# Altium schematic sheet Main_Schematic.SchDoc
size A4; SheetNumber: 1; SheetTotal: 5
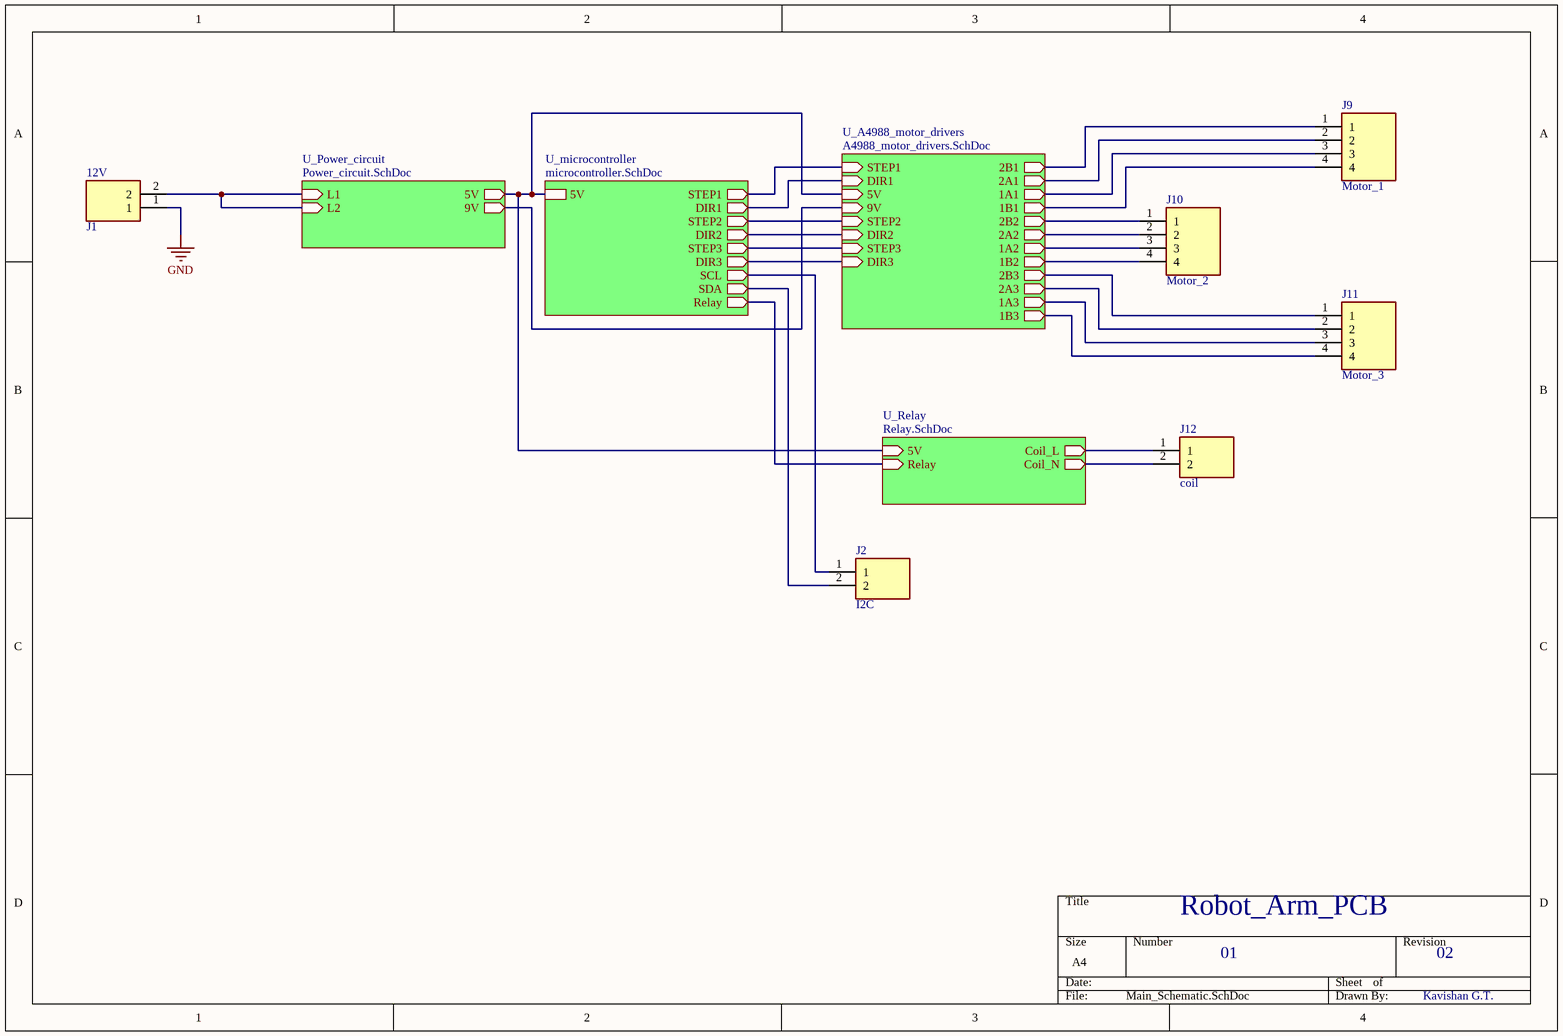
[diagram p0: Main_Schematic.SchDoc]

## Parts
J1  12V  [SHDR2W64P0X250_1X2_750X380X600P]
J2  I2C  [SHDR2W64P0X250_1X2_750X380X600P]
J9  Motor_1  [RHDR4W80P0X254_1X4_1066X254X850P]
J10  Motor_2  [RHDR4W80P0X254_1X4_1066X254X850P]
J11  Motor_3  [RHDR4W80P0X254_1X4_1066X254X850P]
J12  coil  [SHDR2W64P0X250_1X2_750X380X600P]

## Sub-sheets
U_A4988_motor_drivers = A4988_motor_drivers.SchDoc: STEP1 (in), DIR1 (in), 5V (in), 9V (in), 2B1 (out), 2A1 (out), 1A1 (out), 1B1 (out), STEP2 (in), DIR2 (in), 2B2 (out), 2A2 (out), 1A2 (out), 1B2 (out), STEP3 (in), DIR3 (in), 2B3 (out), 2A3 (out), 1A3 (out), 1B3 (out)
U_microcontroller = microcontroller.SchDoc: 5V, STEP1 (out), DIR1 (out), STEP2 (out), DIR2 (out), STEP3 (out), DIR3 (out), SCL (out), SDA (out), Relay (out)
U_Power_circuit = Power_circuit.SchDoc: L1 (in), 5V (out), L2 (in), 9V (out)
U_Relay = Relay.SchDoc: 5V (in), Relay (in), Coil_L (out), Coil_N (out)

## Nets
GND: J1.1
NetJ1_2: J1.2 ; sheet U_Power_circuit/L1, sheet U_Power_circuit/L2
NetJ2_1: J2.1 ; sheet U_microcontroller/SCL
NetJ2_2: J2.2 ; sheet U_microcontroller/SDA
NetJ9_1: J9.1 ; sheet U_A4988_motor_drivers/2B1
NetJ9_2: J9.2 ; sheet U_A4988_motor_drivers/2A1
NetJ9_3: J9.3 ; sheet U_A4988_motor_drivers/1A1
NetJ9_4: J9.4 ; sheet U_A4988_motor_drivers/1B1
NetJ10_1: J10.1 ; sheet U_A4988_motor_drivers/2B2
NetJ10_2: J10.2 ; sheet U_A4988_motor_drivers/2A2
NetJ10_3: J10.3 ; sheet U_A4988_motor_drivers/1A2
NetJ10_4: J10.4 ; sheet U_A4988_motor_drivers/1B2
NetJ11_1: J11.1 ; sheet U_A4988_motor_drivers/2B3
NetJ11_2: J11.2 ; sheet U_A4988_motor_drivers/2A3
NetJ11_3: J11.3 ; sheet U_A4988_motor_drivers/1A3
NetJ11_4: J11.4 ; sheet U_A4988_motor_drivers/1B3
NetJ12_1: J12.1 ; sheet U_Relay/Coil_L
NetJ12_2: J12.2 ; sheet U_Relay/Coil_N
(unnamed): sheet U_microcontroller/5V, sheet U_A4988_motor_drivers/5V, sheet U_Relay/5V, sheet U_Power_circuit/5V
(unnamed): sheet U_microcontroller/STEP1, sheet U_A4988_motor_drivers/STEP1
(unnamed): sheet U_microcontroller/DIR1, sheet U_A4988_motor_drivers/DIR1
(unnamed): sheet U_microcontroller/STEP2, sheet U_A4988_motor_drivers/STEP2
(unnamed): sheet U_microcontroller/DIR2, sheet U_A4988_motor_drivers/DIR2
(unnamed): sheet U_microcontroller/STEP3, sheet U_A4988_motor_drivers/STEP3
(unnamed): sheet U_microcontroller/DIR3, sheet U_A4988_motor_drivers/DIR3
(unnamed): sheet U_microcontroller/Relay, sheet U_Relay/Relay
(unnamed): sheet U_A4988_motor_drivers/9V, sheet U_Power_circuit/9V

## Notes on the sheet
- Robot_Arm_PCB
- 01
- 02
- Kavishan G.T.

## Library data of the parts
J1 J2 J12 = B2B-EH-A: Connector; Manufacturer_Name: JST (JAPAN SOLDERLESS TERMINALS); Datasheet Link: http://www.jst-mfg.com/product/pdf/eng/eEH.pdf; Height: 6mm; Manufacturer_Part_Number: B2B-EH-A
J9-J11 = PPPC041LFBN-RC: Connector; Manufacturer_Name: Sullins; Datasheet Link: https://drawings-pdf.s3.amazonaws.com/10492.pdf; Height: 8.5mm; Manufacturer_Part_Number: PPPC041LFBN-RC